# EAGLE design Stereo_Deck (EAGLE 7.6.0)
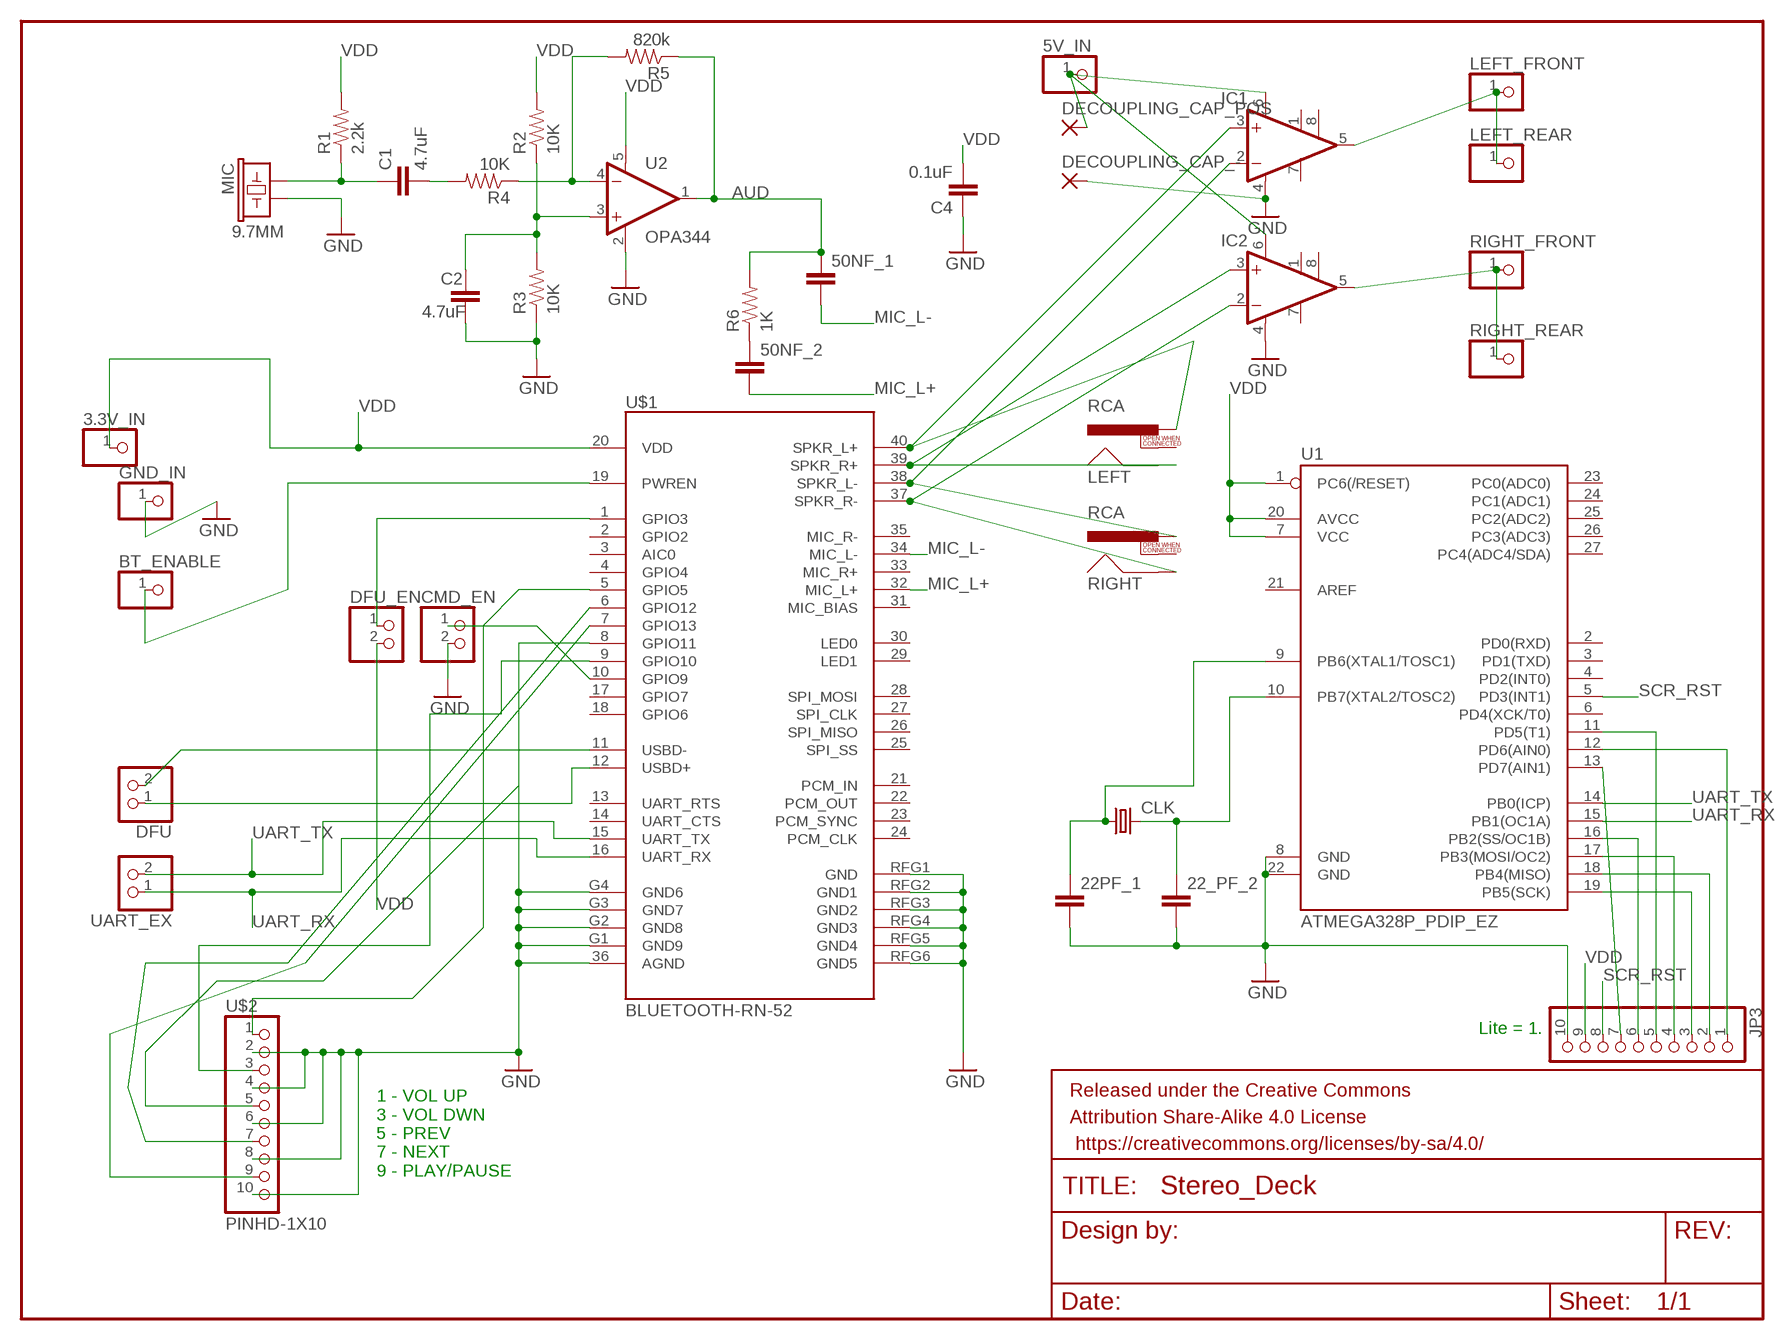
[diagram p0: schematic, sheet 1]

## Parts
3.3V_IN  PINHD-1X1  [1X01]
5V_IN  PINHD-1X1  [1X01]
22_PF_2  CC0603  [C0603]
22PF_1  CC0603  [C0603]
50NF_1  CC0603  [C0603]
50NF_2  CC0603  [C0603]
BT_ENABLE  PINHD-1X1  [1X01]
C1  4.7uF  4.7UF-6.3V-10%(0603)0603  [0603-CAP]
C2  4.7uF  4.7UF-6.3V-10%(0603)0603  [0603-CAP]
C4  0.1uF  0.1UF-25V(+80/-20%)(0603)  [0603-CAP]
CLK  CRYSTALHC49US  [HC49US]
CMD_EN  PINHD-1X2  [1X02]
DECOUPLING_CAP_-  2,15/1,0  [2,15/1,0]
DECOUPLING_CAP_POS  2,15/1,0  [2,15/1,0]
DFU  PINHD-1X2  [1X02]
DFU_EN  PINHD-1X2  [1X02]
FRAME1  FRAME-LETTER  [CREATIVE_COMMONS]
GND_IN  PINHD-1X1  [1X01]
IC1  LM386N-1  [DIL08]
IC2  LM386N-1  [DIL08]
JP3  PINHD-1X10  [1X10]
LEFT  RCA  [RCA]
LEFT_FRONT  PINHD-1X1  [1X01]
LEFT_REAR  PINHD-1X1  [1X01]
MIC  9.7MM  MIC9.7MM  [MIC-9.7MM]
R1  2.2k  2.2KOHM-1/10W-1%(0603)  [0603-RES]
R2  10K  10KOHM-1/10W-1%(0603)0603  [0603-RES]
R3  10K  10KOHM-1/10W-1%(0603)0603  [0603-RES]
R4  10K  10KOHM-1/10W-1%(0603)0603  [0603-RES]
R5  820k  820KOHM-1/10W-1%(0603)  [0603-RES]
R6  1K  10KOHM-1/10W-1%(0603)0603  [0603-RES]
RIGHT  RCA  [RCA]
RIGHT_FRONT  PINHD-1X1  [1X01]
RIGHT_REAR  PINHD-1X1  [1X01]
U1  ATMEGA328P_PDIP_EZ  [DIL28-EZ]
U2  OPA344  [SOT23-5]
U$1  BLUETOOTH-RN-52  [RN-52]
U$2  PINHD-1X10  [1X10-BIG]
UART_EX  PINHD-1X2  [1X02]

## Nets
AUD: 50NF_1.1 R5.1 R6.2 U2.1(OUT)
CMD_EN: CMD_EN.1 U$1.10(GPIO9)
DFU_EN: DFU_EN.1 U$1.1(GPIO3)
GND: 22_PF_2.2 22PF_1.2 C2.2 C4.1 CMD_EN.2 DECOUPLING_CAP_-.1(P) GND_IN.1 IC1.4(GND) IC2.4(GND) JP3.10 MIC.2 R3.1 U1.8(GND) U1.22(GND) U2.2(V-) U$1.36(AGND) U$1.G1(GND9) U$1.G2(GND8) U$1.G3(GND7) U$1.G4(GND6) U$1.RFG1(GND) U$1.RFG2(GND1) U$1.RFG3(GND2) U$1.RFG4(GND3) U$1.RFG5(GND4) U$1.RFG6(GND5) U$2.2 U$2.4 U$2.6 U$2.8 U$2.10
MIC_L+: 50NF_2.2 U$1.32(MIC_L+)
MIC_L-: 50NF_1.2 U$1.34(MIC_L-)
N$1: 22PF_1.1 CLK.1 U1.9(PB6(XTAL1/TOSC1))
N$2: JP3.1 U1.12(PD6(AIN0))
N$3: JP3.2 U1.18(PB4(MISO))
N$4: IC1.3(+IN) LEFT.PIN U$1.40(SPKR_L+)
N$5: IC2.3(+IN) LEFT.SHELL U$1.39(SPKR_R+)
N$6: IC1.2(-IN) RIGHT.PIN U$1.38(SPKR_L-)
N$7: DFU.2 U$1.11(USBD-)
N$8: DFU.1 U$1.12(USBD+)
N$9: BT_ENABLE.1 U$1.19(PWREN)
N$10: JP3.3 U1.19(PB5(SCK))
N$11: JP3.4 U1.17(PB3(MOSI/OC2))
N$12: JP3.5 U1.11(PD5(T1))
N$13: JP3.6 U1.16(PB2(SS/OC1B))
N$14: JP3.7 U1.13(PD7(AIN1))
N$15: 22_PF_2.1 CLK.2 U1.10(PB7(XTAL2/TOSC2))
N$16: C1.1 MIC.1 R1.1
N$17: IC2.2(-IN) RIGHT.SHELL U$1.37(SPKR_R-)
N$18: R4.1 R5.2 U2.4(-IN)
N$19: C1.2 R4.2
N$20: C2.1 R2.1 R3.2 U2.3(+IN)
N$21: 50NF_2.1 R6.1
N$22: 5V_IN.1 DECOUPLING_CAP_POS.1(P) IC1.6(VS) IC2.6(VS)
N$23: DFU_EN.2
N$24: U$1.5(GPIO5) U$2.1
N$25: U$1.9(GPIO10) U$2.3
N$26: U$1.8(GPIO11) U$2.5
N$27: U$1.6(GPIO12) U$2.7
N$28: U$1.7(GPIO13) U$2.9
N$29: IC2.5(OUT) RIGHT_FRONT.1 RIGHT_REAR.1
N$30: IC1.5(OUT) LEFT_FRONT.1 LEFT_REAR.1
SCR_RST: JP3.8 U1.5(PD3(INT1))
UART_RX: U1.15(PB1(OC1A)) U$1.16(UART_RX) UART_EX.1
UART_TX: U1.14(PB0(ICP)) U$1.15(UART_TX) UART_EX.2
VDD: 3.3V_IN.1 C4.2 JP3.9 R1.2 R2.2 U1.1(PC6(/RESET)) U1.7(VCC) U1.20(AVCC) U2.5(V+) U$1.20(VDD)
Unconnected: IC1.1(GAIN) IC1.7(BYPASS) IC1.8(GAIN) IC2.1(GAIN) IC2.7(BYPASS) IC2.8(GAIN) LEFT.SWITCH RIGHT.SWITCH U1.2(PD0(RXD)) U1.3(PD1(TXD)) U1.4(PD2(INT0)) U1.6(PD4(XCK/T0)) U1.21(AREF) U1.23(PC0(ADC0)) U1.24(PC1(ADC1)) U1.25(PC2(ADC2)) U1.26(PC3(ADC3)) U1.27(PC4(ADC4/SDA)) U$1.2(GPIO2) U$1.3(AIC0) U$1.4(GPIO4) U$1.13(UART_RTS) U$1.14(UART_CTS) U$1.17(GPIO7) U$1.18(GPIO6) U$1.21(PCM_IN) U$1.22(PCM_OUT) U$1.23(PCM_SYNC) U$1.24(PCM_CLK) U$1.25(SPI_SS) U$1.26(SPI_MISO) U$1.27(SPI_CLK) U$1.28(SPI_MOSI) U$1.29(LED1) U$1.30(LED0) U$1.31(MIC_BIAS) U$1.33(MIC_R+) U$1.35(MIC_R-)

## Notes on the sheet
- Lite = 1.
- 1 - VOL UP
  3 - VOL DWN
  5 - PREV
  7 - NEXT
  9 - PLAY/PAUSE

## Library data of the parts
3.3V_IN 5V_IN BT_ENABLE GND_IN LEFT_FRONT LEFT_REAR RIGHT_FRONT RIGHT_REAR = adafruit:PINHD-1X1: Pin header 1x1 for 0.1" spacing With round pins
22_PF_2 22PF_1 50NF_1 50NF_2 = eagle-ltspice:C: CAPACITOR, European symbol; SPICEMODEL: NONE; SPICEPREFIX: C
C1 C2 = SparkFun-Capacitors:4.7UF-6.3V-10%(0603): CAP-08280; PROD_ID: CAP-08280
C4 = SparkFun-Capacitors:0.1UF-25V(+80/-20%)(0603): CAP-00810 Ceramic Standard decoupling cap; PROD_ID: CAP-00810
CLK = SparkFun-FreqCtrl:CRYSTAL: Various standard crystals. Proven footprints.
CMD_EN DFU DFU_EN UART_EX = pinhead:PINHD-1X2: PIN HEADER
DECOUPLING_CAP_- DECOUPLING_CAP_POS = wirepad:2,15/1,0: THROUGH-HOLE PAD
FRAME1 = SparkFun-Aesthetics:FRAME-LETTER: Schematic Frame Standard 8.5x11 US Letter frame
IC1 IC2 = Audio-Power-amlifier V.2.0:LM386?-*: Low Voltage Audio Power Amplifier Source: http://cache.national.com/ds/LM/LM386.pdf
JP3 = pinhead:PINHD-1X10: PIN HEADER
LEFT RIGHT = SparkFun-Connectors:RCA
MIC = SparkFun-Sensors:MIC: Omni-directional electret microphone. 9.7mm standard diameter.; PROD_ID: COMP-08856
R1 = SparkFun-Resistors:2.2KOHM-1/10W-1%(0603): RES-08272; PROD_ID: RES-08272
R2-R4 = SparkFun-Resistors:10KOHM-1/10W-1%(0603): RES-00824; PROD_ID: RES-00824
R5 = SparkFun-Resistors:820KOHM-1/10W-1%(0603); PROD_ID: RES-13247
R6 = SparkFun-Resistors:10KOHM-1/10W-1%(0603): RES-00824; PROD_ID: RES-00824; VALUE: 10K
U1 = SparkFun-DigitalIC:ATMEGA328P_PDIP_EZ: uC used in the Arduino 32kb flash, 1k EEPROM, 2k SRAM This is the through-hole version of this chip.
U2 = SparkFun-AnalogIC:OPA344: Single gate rail-to-rail output op-amp. Inputs extend 300mV past rails.; PROD_ID: IC-08251
U$1 = SparkFun-RF:BLUETOOTH-RN-52
U$2 = adafruit:PINHD-1X10: Pin header 1x10 0.1" spacing With round pins

## Board
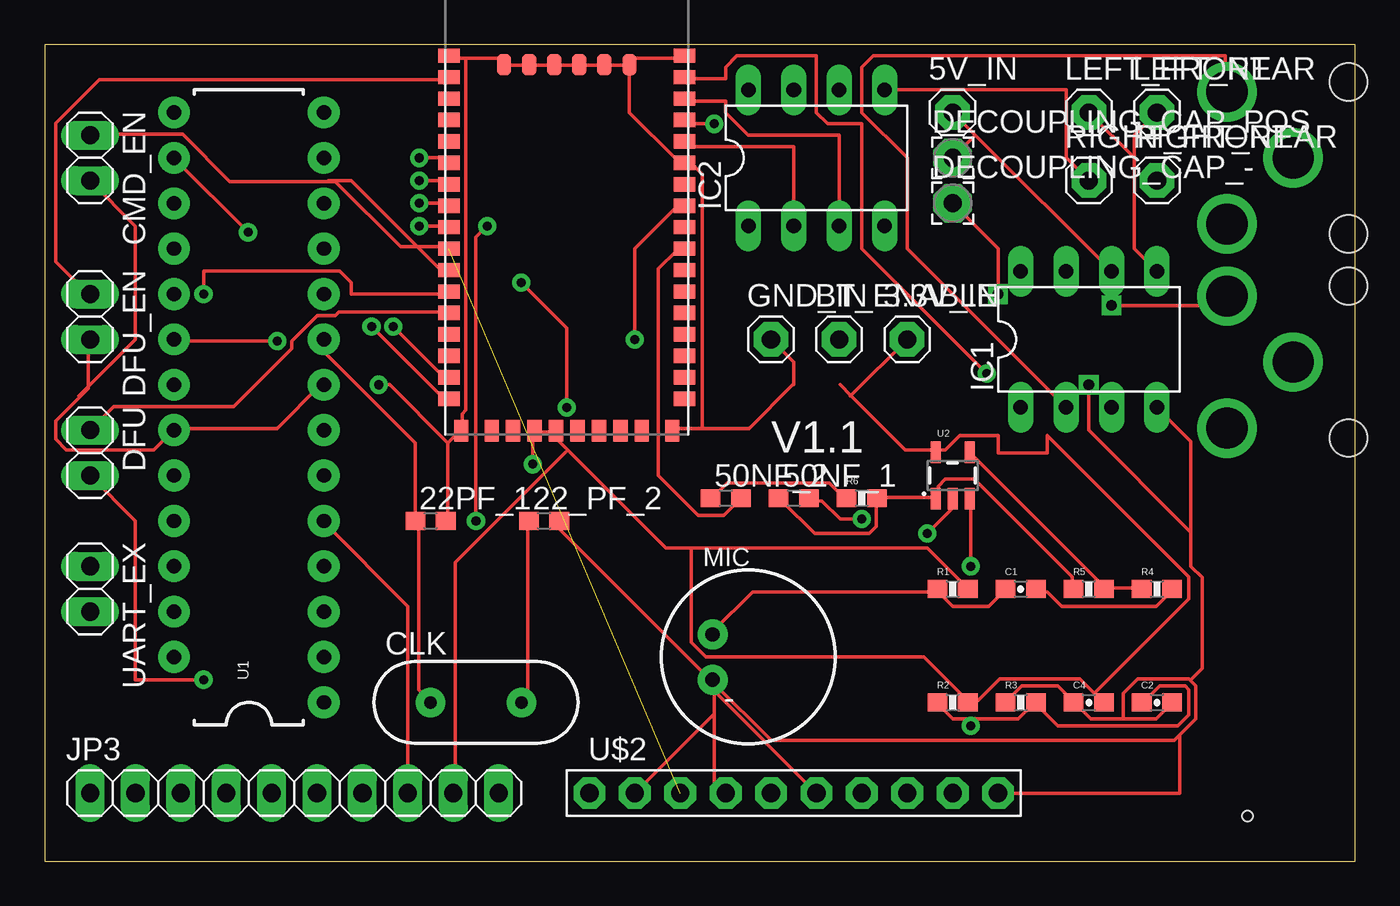
[diagram p1: board, top side]
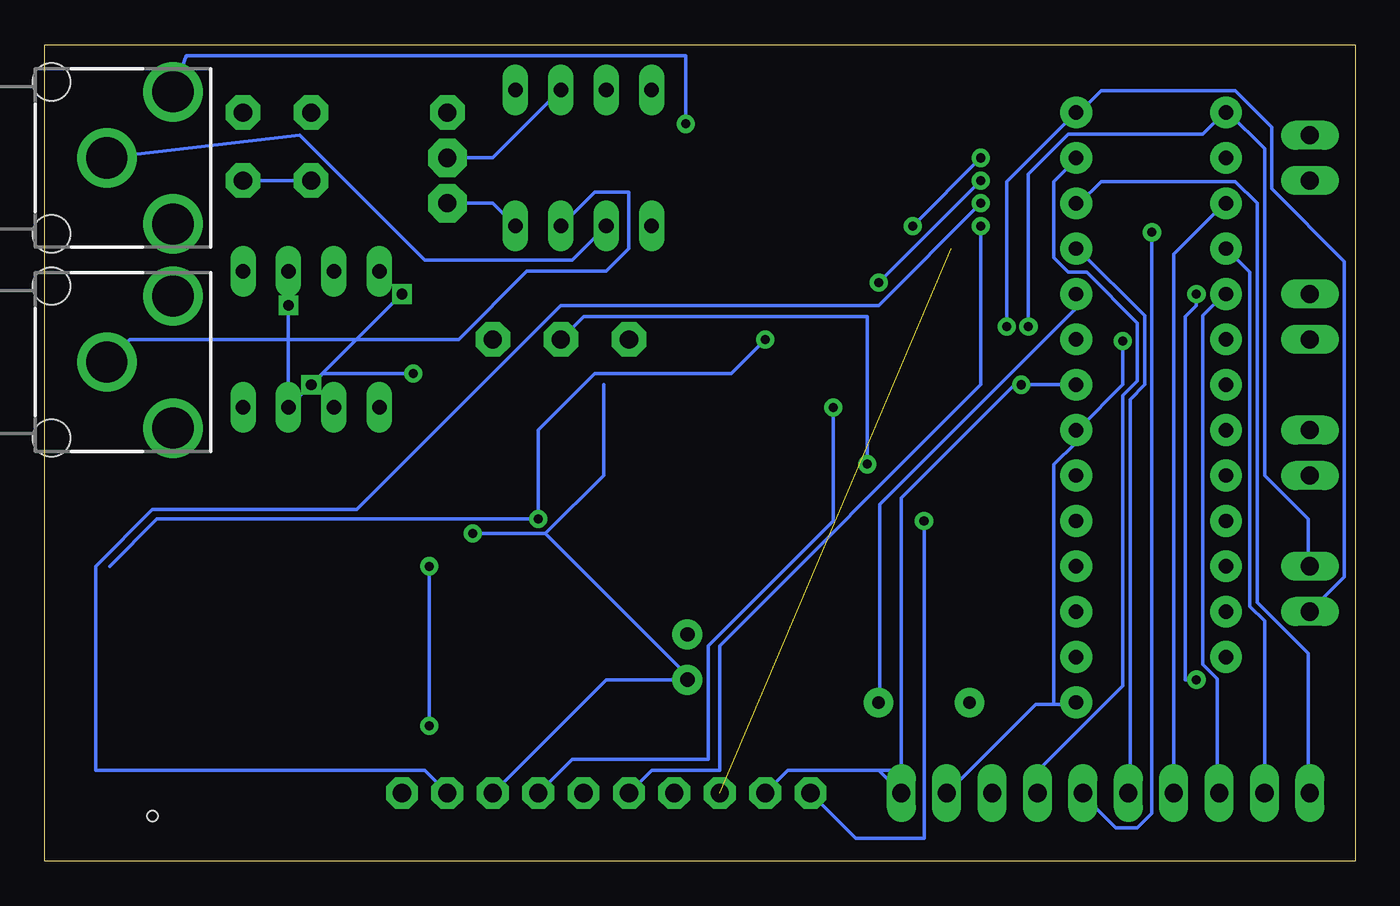
[diagram p2: board, bottom side, seen from below]

Size 73.33 x 45.71 mm. Coordinates in mm from the lower left corner, seen from the top.
Outline: 0,0 73.33,0 73.33,45.71 0,45.71 0,0
Copper layers (1*16): Top 0.035mm / dielectric 1.5mm / Bottom 0.035mm
Design rules "SparkFun": minimum track width 8mil, minimum drill 20mil, track to track 8mil, track to pad 8mil, pad to pad 8mil, via to via 8mil, smd to smd 8mil, copper to edge 8mil, drill to drill 8mil, minimum pad ring 12mil, minimum via ring 10mil, stop-mask expansion 4mil, vias tented up to drill 20mil, thermal gap 10mil
Holes 0.6 mm at 67.31,2.54

### Footprints (pad centres in the part's own frame; a part is rotated, then mirrored left to right if it is on the bottom)
1X01 = drill 1.016 pad 1.93 octagon: 1 0,0
C0603 = smd 1.1 x 1: 1 -0.85,0; 2 0.85,0
0603-CAP = smd 1.1 x 1: 1 -0.85,0; 2 0.85,0
HC49US = drill 0.7 pad 1.651: 1 -2.54,0; 2 2.54,0
1X02 = drill 1.016 long: 1 -1.27,0; 2 1.27,0
2,15/1,0 = drill 1.016 pad 2.159 octagon: 1 0,0
DIL08 = drill 0.813 pad 1.27 long: 1 -3.81,-3.81; 2 -1.27,-3.81; 3 1.27,-3.81; 4 3.81,-3.81; 5 3.81,3.81; 6 1.27,3.81; 7 -1.27,3.81; 8 -3.81,3.81
1X10 = drill 1.016 long: 1 -11.43,0; 2 -8.89,0; 3 -6.35,0; 4 -3.81,0; 5 -1.27,0; 6 1.27,0; 7 3.81,0; 8 6.35,0; 9 8.89,0; 10 11.43,0
RCA = drill 2.3: PIN 3.7,3.7; SHELL 0,0; SWITCH 3.7,-3.7 | hole 2.1: -3.1,4.25; -3.1,-4.25
MIC-9.7MM = drill 0.8 pad 1.676: 1 -2,1.27; 2 -2,-1.27
0603-RES = smd 1.1 x 1: 1 -0.85,0; 2 0.85,0
DIL28-EZ = drill 0.8 pad 1.778: 1 -16.51,-4.191; 2 -13.97,-4.191; 3 -11.43,-4.191; 4 -8.89,-4.191; 5 -6.35,-4.191; 6 -3.81,-4.191; 7 -1.27,-4.191; 8 1.27,-4.191; 9 3.81,-4.191; 10 6.35,-4.191; 11 8.89,-4.191; 12 11.43,-4.191; 13 13.97,-4.191; 14 16.51,-4.191; 15 16.51,4.191; 16 13.97,4.191; 17 11.43,4.191; 18 8.89,4.191; 19 6.35,4.191; 20 3.81,4.191; 21 1.27,4.191; 22 -1.27,4.191; 23 -3.81,4.191; 24 -6.35,4.191; 25 -8.89,4.191; 26 -11.43,4.191; 27 -13.97,4.191
SOT23-5 = smd 0.55 x 1.2: 1 -0.95,-1.3; 2 0,-1.3; 3 0.95,-1.3; 4 0.95,1.3; 5 -0.95,1.3
RN-52 = smd 1.2 x 0.8: 1 -6.6,8.33; 2 -6.6,7.13; 3 -6.6,5.93; 4 -6.6,4.73; 5 -6.6,3.53; 6 -6.6,2.33; 7 -6.6,1.13; 8 -6.6,-0.07; 9 -6.6,-1.27; 10 -6.6,-2.47; 11 -6.6,-3.67; 12 -6.6,-4.87; 13 -6.6,-6.07; 14 -6.6,-7.27; 15 -6.6,-8.47; 16 -6.6,-9.67; 25 6.6,-9.67; 26 6.6,-8.47; 27 6.6,-7.27; 28 6.6,-6.07; 29 6.6,-4.87; 30 6.6,-3.67; 31 6.6,-2.47; 32 6.6,-1.27; 33 6.6,-0.07; 34 6.6,1.13; 35 6.6,2.33; 36 6.6,3.53; 37 6.6,4.73; 38 6.6,5.93; 39 6.6,7.13; 40 6.6,8.33; G1 -6.6,9.53; G4 6.6,9.53 | smd 0.8 x 1.2: 17 -4.2,-11.47; 18 -3,-11.47; 19 -1.8,-11.47; 20 -0.6,-11.47; 21 0.6,-11.47; 22 1.8,-11.47; 23 3,-11.47; 24 4.2,-11.47; G2 -5.9,-11.47; G3 5.9,-11.46; RFG1 -3.5,9.03; RFG2 -2.1,9.03; RFG3 -0.7,9.03; RFG4 0.7,9.03; RFG5 2.1,9.03; RFG6 3.5,9.03
1X10-BIG = drill 1.016 pad 1.778 octagon: 1 -11.43,0; 2 -8.89,0; 3 -6.35,0; 4 -3.81,0; 5 -1.27,0; 6 1.27,0; 7 3.81,0; 8 6.35,0; 9 8.89,0; 10 11.43,0

### Placement (x,y rotation side)
3.3V_IN  48.26,29.21 0 top
5V_IN  50.8,41.91 0 top
22_PF_2  27.94,19.05 0 top
22PF_1  21.59,19.05 0 top
50NF_1  41.91,20.32 0 top
50NF_2  38.1,20.32 0 top
BT_ENABLE  44.45,29.21 0 top
C1  54.61,15.24 0 top
C2  62.23,8.89 0 top
C4  58.42,8.89 0 top
CLK  24.13,8.89 0 top
CMD_EN  2.54,39.37 270 top
DECOUPLING_CAP_-  50.8,36.83 0 top
DECOUPLING_CAP_POS  50.8,39.37 0 top
DFU  2.54,22.86 270 top
DFU_EN  2.54,30.48 270 top
FRAME1  -101.6,-5.08 0 top  (outside the outline)
GND_IN  40.64,29.21 0 top
IC1  58.42,29.21 0 top
IC2  43.18,39.37 0 top
JP3  13.97,3.81 0 top
LEFT  69.85,27.94 0 bottom
LEFT_FRONT  58.42,41.91 0 top
LEFT_REAR  62.23,41.91 0 top
MIC  39.37,11.43 0 top
R1  50.8,15.24 0 top
R2  50.8,8.89 0 top
R3  54.61,8.89 0 top
R4  62.23,15.24 0 top
R5  58.42,15.24 0 top
R6  45.72,20.32 0 top
RIGHT  69.85,39.37 0 bottom
RIGHT_FRONT  58.42,38.1 0 top
RIGHT_REAR  62.23,38.1 0 top
U1  11.43,25.4 90 top
U2  50.8,21.59 0 top
U$1  29.21,35.56 0 top
U$2  41.91,3.81 0 top
UART_EX  2.54,15.24 270 top

### Tracks (layer width: path | path; a pad name or v marks a point on that pad's centre or on a via)
AUD
  Top 0.203: 50NF_1.1 41.25,20.17 43.08,18.34 46.13,18.34 46.53,18.74 46.53,20.17 R6.2 46.74,20.37 49.78,20.37 U2.1 49.99,20.37 49.99,20.98 50.39,21.39 52.02,21.39 57.51,15.9 57.51,15.29 R5.1
CMD_EN
  Top 0.203: 22.55,34.39 19.91,34.39 16.26,38.05 15.88,38.05 | 15.88,38.05 10.36,38.05 7.72,40.69 2.64,40.69 CMD_EN.1 | U$1.10 22.23,33.02 17.14,38.1 15.88,38.1 15.88,38.05
DFU_EN
  Top 0.203: U$1.1 22.55,43.74 3.05,43.74 0.61,41.3 0.61,33.58 2.44,31.75 DFU_EN.1
GND  (via drill 0.51, 0.6)
  Top 0.203: 36.78,24.23 39.42,24.23 41.86,26.67 41.91,26.67 41.91,27.94 GND_IN.1 | 36.78,24.23 35.15,24.23 U$1.G3 | U2.2 50.8,19.76 v49.38,18.34 | R3.1 53.85,8.99 54.66,9.8 56.69,9.8 57.51,8.99 C4.1 57.71,8.79 58.52,7.98 60.35,7.98 | 60.35,7.98 62.18,7.98 62.99,8.79 C2.2 | 22_PF_2.2 28.85,18.95 28.85,18.54 37.19,10.21 MIC.2 | 60.35,7.98 60.35,9.4 61.16,10.21 64.01,10.21 64.1,10.12 | 64.1,10.12 64.41,9.8 64.41,7.98 63.46,7.02 | 63.46,7.02 63.2,6.76 40.64,6.76 37.39,10.01 MIC.2 | U1.8 15.44,26.67 13.01,24.23 7.32,24.23 U1.22 7.11,24.03 6.1,23.01 1.22,23.01 0.61,23.62 0.61,24.64 1.96,25.98 | 2.44,29.11 2.44,26.47 1.96,25.98 | U$1.RFG6 32.51,44.55 31.5,44.55 U$1.RFG5 31.29,44.55 30.07,44.55 U$1.RFG4 29.87,44.55 28.65,44.55 U$1.RFG3 28.45,44.55 27.23,44.55 U$1.RFG2 27.03,44.55 25.81,44.55 U$1.RFG1 25.6,44.76 25.4,44.96 23.57,44.96 | U$1.RFG6 32.72,44.55 32.72,41.91 35.36,39.27 35.76,39.27 U$1.36 35.97,39.27 36.78,38.46 36.78,24.23 | U$1.G4 35.76,44.96 32.92,44.96 32.72,44.76 U$1.RFG6 | 22.55,23.42 22.55,19.15 22PF_1.2 | 22.55,23.42 23.16,24.03 U$1.G2 23.37,24.23 23.37,25.04 23.57,25.25 23.57,44.96 | 23.57,44.96 22.76,44.96 U$1.G1 | v18.69,26.67 19.3,26.67 22.55,23.42 | CMD_EN.2 5.08,35.56 5.08,29.21 1.91,26.04 1.96,25.98 | IC1.4 64.14,23.49 64.14,18.41 | 64.14,18.41 64.14,16.51 64.77,15.88 64.77,10.8 64.1,10.12 | U$2.4 37.47,4.45 37.47,8.26 | 37.47,9.52 37.47,10.16 MIC.2 | 37.47,9.52 37.47,8.26 | 37.47,9.52 U$2.6 | 37.47,9.52 MIC.2 | U$2.10 63.5,3.81 63.5,6.98 63.46,7.02 | DECOUPLING_CAP_-.1 53.34,34.29 v53.34,31.75 | v58.42,26.67 58.42,24.13 64.14,18.41 | 37.47,8.26 U$2.2
  Bottom 0.203: 45.31,18.34 v49.38,18.34 | 45.31,18.34 42.06,21.59 42.06,26.67 | 45.31,18.34 37.19,10.21 MIC.2 41.91,10.16 U$2.8 | U1.8 v18.69,26.67 19.05,26.67 25.4,20.32 25.4,5.08 26.67,5.08 | 26.67,5.08 JP3.10 | 26.67,5.08 31.75,5.08 U$2.2 | IC2.4 48.26,36.83 DECOUPLING_CAP_-.1 | v58.42,26.67 v53.34,31.75
MIC_L+
  Top 0.203: 50NF_2.2 38.81,20.17 38,19.36 36.58,19.36 34.34,21.59 34.34,33.17 35.36,34.19 35.76,34.19 U$1.32
MIC_L-  (via drill 0.51)
  Top 0.203: v45.72,19.15 44.5,19.15 43.48,20.17 42.88,20.17 50NF_1.2 | v33.02,29.21 33.02,34.29 35.56,36.83 U$1.34
  Bottom 0.203: v45.72,19.15 67.06,19.15 69.7,16.51 | v33.02,29.21 34.92,27.3 42.55,27.3 45.72,24.13 v45.72,19.15 | 45.72,19.05 v45.72,19.15
N$1
  Top 0.203: CLK.1 21.54,8.99 20.93,9.6 20.93,18.95 22PF_1.1 20.73,19.15 20.73,23.42 15.65,28.5 15.65,29.11 U1.9
N$2
  Bottom 0.203: JP3.1 2.64,3.91 2.64,11.63 5.49,14.48 5.49,36.83 6.71,38.05 14.22,38.05 15.44,36.83 U1.12
N$3
  Bottom 0.203: JP3.2 5.08,13.46 5.89,14.27 5.89,32.97 7.11,34.19 U1.18
N$4  (via drill 0.51, 0.6)
  Top 0.203: v52.7,27.3 45.72,34.29 45.72,41.27 43.81,41.27 43.18,41.91 43.18,45.09 38.73,45.09 38.1,44.45 38.1,43.82 36.2,43.82 U$1.40 | v59.69,31.12 66.04,31.12 LEFT.PIN
  Bottom 0.203: v52.7,27.3 57.78,27.3 IC1.3 v59.69,31.12
N$5
  Top 0.203: IC2.3 44.45,40.64 39.37,40.64 38.1,41.91 38.1,42.54 36.2,42.54 U$1.39
  Bottom 0.203: LEFT.SHELL 68.58,29.21 50.16,29.21 46.35,33.02 41.91,33.02 40.64,34.29 40.64,37.46 42.55,37.46 IC2.3
N$6  (via drill 0.51)
  Top 0.203: v37.47,41.27 36.2,41.27 U$1.38 | IC1.2 48.26,34.29 48.26,39.37 45.72,41.91 45.72,44.45 46.35,45.09 66.04,45.09 66.04,44.45 RIGHT.PIN
  Bottom 0.203: v37.47,41.27 37.47,45.09 65.41,45.09 RIGHT.PIN
N$7  (via drill 0.51)
  Top 0.203: v8.89,31.75 8.89,33.02 16.51,33.02 17.14,32.38 17.14,31.75 22.23,31.75 U$1.11 | v8.89,10.16 5.08,10.16 5.08,19.05 DFU.2
  Bottom 0.203: v8.89,31.75 8.89,31.12 9.53,30.48 9.53,10.16 v8.89,10.16
N$8
  Top 0.203: DFU.1 3.86,25.45 10.57,25.45 13.82,28.7 13.82,29.11 15.24,30.53 16.26,30.53 16.46,30.73 22.55,30.73 U$1.12
N$9  (via drill 0.51)
  Top 0.203: v27.3,22.23 27.3,23.49 U$1.19
  Bottom 0.203: v27.3,22.23 27.3,30.48 43.18,30.48 BT_ENABLE.1
N$10
  Bottom 0.203: JP3.3 7.72,3.91 7.72,10.21 8.53,11.02 8.53,30.53 7.32,31.75 U1.19
N$11
  Bottom 0.203: JP3.4 10.16,33.99 7.32,36.83 U1.17
N$12
  Bottom 0.203: JP3.5 12.6,3.91 12.6,25.86 11.79,26.67 11.79,30.53 15.44,34.19 U1.11
N$13  (via drill 0.51)
  Top 0.203: v11.38,35.2 7.32,39.27 U1.16
  Bottom 0.203: v11.38,35.2 11.38,2.69 12.19,1.88 13.41,1.88 15.24,3.71 JP3.6
N$14
  Bottom 0.203: JP3.7 17.68,3.91 17.68,5.13 13.01,9.8 13.01,26.06 12.19,26.87 12.19,30.12 15.04,32.97 16.05,32.97 16.87,33.78 16.87,38.05 15.65,39.27 U1.13
N$15
  Top 0.203: 22_PF_2.1 27.03,18.95 27.03,9.2 26.82,8.99 CLK.2
  Bottom 0.203: U1.10 15.65,31.75 15.65,30.94 26.62,19.96 26.62,8.99 CLK.2
N$16
  Top 0.203: C1.1 53.65,15.09 52.83,14.27 50.8,14.27 49.99,15.09 R1.1 49.78,15.09 39.62,15.09 37.39,12.85 MIC.1
N$17
  Top 0.203: IC2.2 41.91,40.01 36.2,40.01 U$1.37
  Bottom 0.203: IC2.2 43.81,33.65 52.07,33.65 59.05,40.64 RIGHT.SHELL
N$18
  Top 0.203: 59.33,15.29 61.37,15.29 R4.1 | 59.33,15.29 51.82,22.81 U2.4 | 59.33,15.29 R5.2
N$19
  Top 0.203: C1.2 55.47,15.09 56.08,15.09 56.9,14.27 62.18,14.27 62.99,15.09 R4.2
N$20  (via drill 0.51)
  Top 0.203: 51.82,7.98 54.46,7.98 55.27,8.79 R3.2 55.47,8.79 56.69,7.57 63.4,7.57 64.01,8.18 64.01,9.6 63.8,9.8 62.38,9.8 61.57,8.99 C2.1 | 51.82,7.98 50.8,7.98 49.99,8.79 R2.1 | v51.82,16.51 51.82,20.17 U2.3 | 51.82,7.98 v51.82,7.57
  Bottom 0.203: v51.82,7.57 v51.82,16.51
N$21
  Top 0.203: 50NF_2.1 37.39,20.37 38.2,21.18 43.89,21.18 44.7,20.37 R6.1
N$22
  Top 0.203: 5V_IN.1 52.07,40.64 | 52.07,40.64 IC1.6 | 52.07,40.64 DECOUPLING_CAP_POS.1
  Bottom 0.203: IC2.6 48.26,39.37 DECOUPLING_CAP_POS.1
N$24  (via drill 0.51)
  Top 0.203: v20.95,39.37 22.23,39.37 U$1.5 | v24.77,35.56 24.13,34.93 v24.13,19.05
  Bottom 0.203: v24.77,35.56 v20.95,39.37 | v24.13,19.05 24.13,1.27 27.94,1.27 U$2.1
N$25  (1 unrouted)
N$26  (via drill 0.51)
  Top 0.203: v20.95,35.56 22.23,35.56 U$1.8
  Bottom 0.203: v20.95,35.56 20.95,26.67 35.56,12.06 35.56,5.08 39.37,5.08 U$2.5
N$27  (via drill 0.51)
  Top 0.203: v20.95,38.1 22.23,38.1 U$1.6 | v26.67,32.38 29.21,29.85 v29.21,25.4
  Bottom 0.203: v26.67,32.38 v20.95,38.1 | v29.21,25.4 29.21,19.05 36.2,12.06 36.2,5.72 43.81,5.72 U$2.7
N$28  (via drill 0.51)
  Top 0.203: v20.95,36.83 22.23,36.83 U$1.7
  Bottom 0.203: v20.95,36.83 26.67,31.12 44.45,31.12 55.88,19.69 67.31,19.69 70.48,16.51 70.48,5.08 52.07,5.08 U$2.9
N$29
  Top 0.203: IC2.5 57.15,43.18 57.15,39.37 RIGHT_FRONT.1
  Bottom 0.203: RIGHT_FRONT.1 RIGHT_REAR.1
N$30
  Top 0.203: IC1.5 60.96,34.29 60.96,39.37 | 60.96,39.37 60.96,40.64 LEFT_REAR.1 | 60.96,39.37 LEFT_FRONT.1
SCR_RST
  Top 0.203: JP3.8 20.32,14.27 15.65,18.95 U1.5
UART_RX  (via drill 0.51)
  Top 0.203: v18.29,29.92 22.15,26.06 22.55,26.06 U$1.16
  Bottom 0.203: v18.29,29.92 18.29,38.46 16.05,40.69 8.53,40.69 7.32,41.91 U1.15 7.11,41.91 5.08,39.88 5.08,21.59 2.64,19.15 2.64,16.51 UART_EX.1
UART_TX  (via drill 0.51)
  Top 0.203: v19.51,29.92 22.15,27.28 22.55,27.28 U$1.15
  Bottom 0.203: v19.51,29.92 19.51,38.05 15.65,41.91 U1.14 15.44,41.91 14.22,43.13 6.71,43.13 4.67,41.1 4.67,37.64 0.61,33.58 0.61,15.9 UART_EX.2
VDD  (via drill 0.51)
  Top 0.203: v13.01,29.11 7.32,29.11 U1.20 | 44.5,26.67 45.11,26.06 | 45.11,26.06 48.16,23.01 49.78,23.01 U2.5 49.99,23.01 50.39,23.01 51.21,23.83 53.34,23.83 53.34,22.86 56.08,22.86 56.08,23.83 64.01,15.9 64.01,14.68 58.73,9.4 | 58.73,9.4 59.13,8.99 C4.2 | 58.73,9.4 57.91,10.21 53.44,10.21 52.22,8.99 51.82,8.99 R2.2 51.61,8.99 49.17,11.43 36.98,11.43 36.17,12.24 36.17,17.53 | 36.17,17.53 34.75,17.53 29.26,23.01 | 36.17,17.53 49.38,17.53 51.61,15.29 R1.2 | 29.26,23.01 28.65,23.62 28.65,24.03 U$1.20 28.45,24.03 27.43,24.03 | 29.26,23.01 22.96,16.71 22.96,3.91 JP3.9 | 45.11,26.06 3.3V_IN.1 | 45.09,26.04 45.11,26.06
  Bottom 0.203: JP3.9 17.88,8.79 16.87,8.79 | 16.87,8.79 15.65,8.79 U1.1 | 16.87,8.79 16.87,22.2 15.65,23.42 15.65,24.03 U1.7 15.44,24.23 13.01,26.67 v13.01,29.11

### Text on the board
tPlace: V1.1